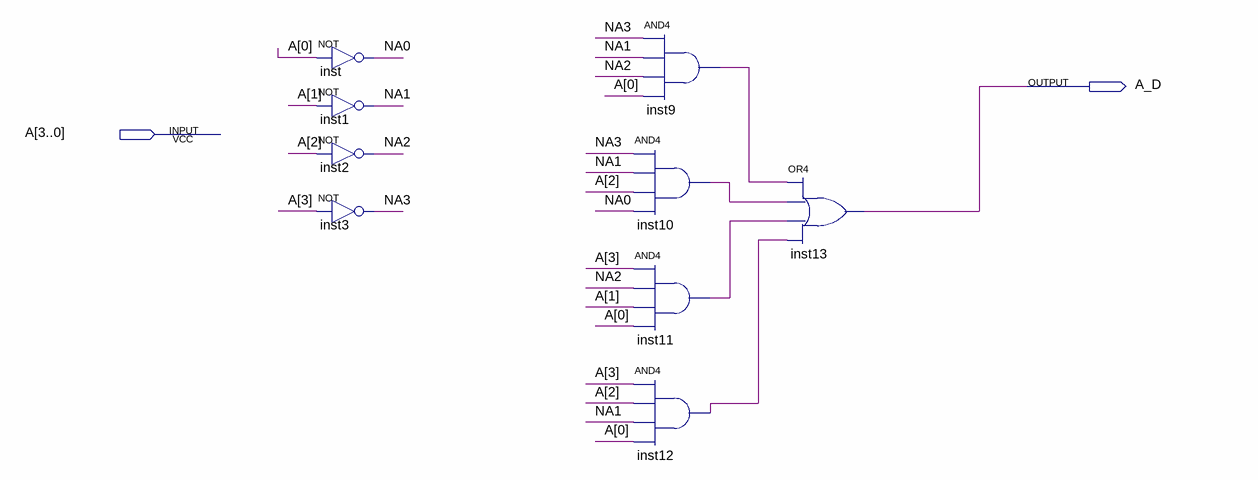
[diagram p0: schematic sheet]
// Quartus schematic Display_A.bdf as structural Verilog: 9 symbols, 2 pins
module Display_A (
  input  [3:0] A,
  output A_D
);

  wire inst9_out, inst10_out, inst11_out, inst12_out, NA0, NA1, NA2, NA3;

  not inst (NA0, A[0]);
  not inst1 (NA1, A[1]);
  not inst2 (NA2, A[2]);
  not inst3 (NA3, A[3]);
  and inst10 (inst10_out, NA3, NA1, A[2], NA0);
  and inst11 (inst11_out, A[3], NA2, A[1], A[0]);
  and inst12 (inst12_out, A[3], A[2], NA1, A[0]);
  and inst9 (inst9_out, NA3, NA1, NA2, A[0]);
  or inst13 (A_D, inst9_out, inst10_out, inst11_out, inst12_out);
endmodule
